# Altium project Light Stairs.PrjPcb
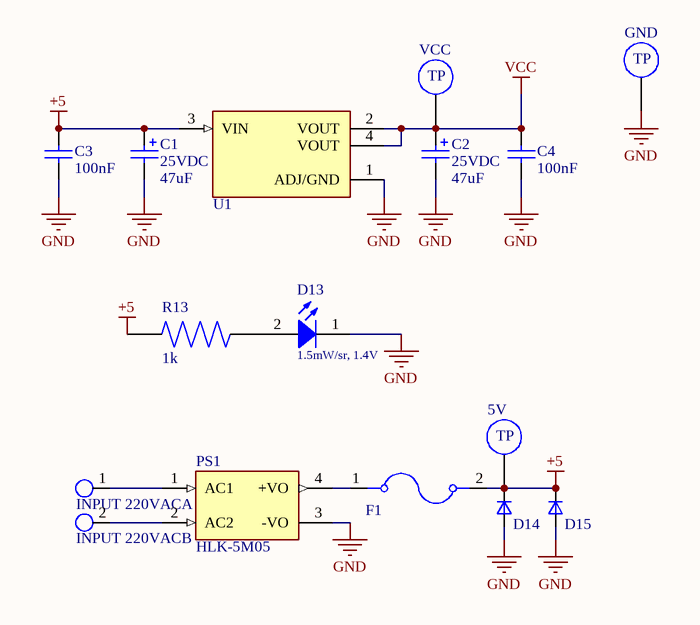
[diagram p0: input.SchDoc]
3 sheets, 76 parts. Net scope: global (net labels, ports and power ports of the same name join across sheets).
Board file: PCB1.PcbDoc
Sheets:
  input.SchDoc
  control.SchDoc
  output.SchDoc

## Sheet input.SchDoc
size A; SheetNumber: 1; SheetTotal: 3

### Parts
(Parts that share a designator on the sheet are numbered #1, #2 ... from top to bottom, then left to right.)
5V  TEST POINT  [Test point]  (value not drawn)  (no BOM)
C1  Rated Voltage: 25VDC  Capacitance: 47uF  [D6.3H7.7]  (hidden comment: Electrolyt Cap)
C2  Rated Voltage: 25VDC  Capacitance: 47uF  [D6.3H7.7]  (hidden comment: Electrolyt Cap)
C3  Capacitance: 100nF  [0603_WAVE]  (hidden comment: Ceramic Cap)
C4  Capacitance: 100nF  [0603_WAVE]  (hidden comment: Ceramic Cap)
D13  1.5mW/sr, 1.4V  [0805_L2W1.3H0.8]
D14  M7 Diode  [SMA]  (value not drawn)
D15  M7 Diode  [SMA]  (value not drawn)
F1  Fuse  [FUSE]  (value not drawn)
GND  TEST POINT  [Test point]  (value not drawn)  (no BOM)
INPUT_220VAC  AK300/2  [AK300/2]  (value not drawn)  (parts A,B of 2)
PS1  HLK-5M05  [HLK-5M05]
R13  value 1k  [1206]  (hidden comment: 1206 Res)
U1#1  AMS1117  [SOT229P700X180-4N]  (value not drawn)
VCC  TEST POINT  [Test point]  (value not drawn)  (no BOM)

### Nets
+5: 5V.TP C1.1(P) C3.2 D14.CATHODE D15.CATHODE F1.2 R13.1 U1#1.3(VIN)
GND: C1.2(N) C2.2(N) C3.1 C4.1 D13.1(K) D14.ANNODE D15.ANNODE GND.TP PS1.3(-VO) U1#1.1(ADJ/GND)
VCC: C2.1(P) C4.2 U1#1.2(VOUT) U1#1.4(VOUT) VCC.TP
NetD13_2: D13.2(A) R13.2
NetF1_1: F1.1 PS1.4(+VO)
NetINPUT_220VAC_1: INPUT_220VAC.1(KL) PS1.1(AC1)
NetINPUT_220VAC_2: INPUT_220VAC.2(KL) PS1.2(AC2)

### Library data of the parts
C1 C2 = Electrolyt Cap: WCAP-ASLI Aluminum Electrolytic Capacitor, V-Chip, SMT, D16xH17mm; Manufacturer Part Number: 865080163018; Manufacturer: Wurth Elektronik; Technical Reference: ASEK170682M6R3DVCTHB000; Ripple Current: 1250mA; Capacitance Tolerance: +/-20%; Leakage Current: 428.4uA; Endurance: 2000h; Dissipation Factor: 24%; Packaging: Tape and Reel; Published Date: October 2020; Operating Temperature: -55 to +105degC; Mounting Technology: SMT; Height: 17mm; ComponentLink1Description: Manufacturer; ComponentLink1URL: http://www.we-online.de; ComponentLink2Description: Datasheet; ComponentLink2URL: https://www.we-online.com/catalog/datasheet/865080163018.pdf; Diameter: 16mm
C3 C4 = Ceramic Cap: WCAP-CSGP Multilayer Ceramic Chip Capacitor, General Purpose, size 1812, X7R; Manufacturer Part Number: 885012210019; Manufacturer: Wurth Elektronik; Rated Voltage: 50VDC; Isolation Resistance: >=10GOhm; Capacitance Tolerance: +/-10%; Technical Reference: X7R1812103K050DFCT10000; ComponentLink1Description: Manufacturer; ComponentLink1URL: http://www.we-online.de; ComponentLink2Description: Datasheet; ComponentLink2URL: https://www.we-online.com/catalog/datasheet/885012210019.pdf; Operating Temperature: -55 to +125degC; Packaging: Tape and Reel; Published Date: May 2020; Ceramic Type: X7R; Dissipation Factor: =<2.5%; Height: 1.25mm; Mounting Technology: SMT; Size: 1812
D13 = 0805 Led: WL-SICW SMT Chip LED Infrared Waterclear, size 0805, 1.5mW/sr, 1.4V; Manufacturer Part Number: 15408085BA400; Manufacturer: Wurth Elektronik; Chip Technology: AlGaAs; Forward Voltage max.: 2V; Centroid Wavelength typ.: 845nm; Peak Wavelength typ.: 850nm; Radiant Intensity min.: 0.6mW/sr; Viewing Angle: 140deg; Radiant Intensity typ.: 1.5mW/sr; ComponentLink1Description: Manufacturer; ComponentLink1URL: http://www.we-online.de; ComponentLink2URL: https://www.we-online.com/catalog/datasheet/15408085BA400.pdf; ComponentLink2Description: Datasheet; Emitting Color: Infrared; Forward Voltage typ.: 1.4V; Mounting Technology: SMT; Operating Temperature: -40 to +85degC; Published Date: August 2020; Packaging: Tape and Reel; Size: 0805
D14 D15 = M7 Diode: Diode Standard 400V 1A Surface Mount SMA _DO-214AC_; MF: ON Semiconductor; MP: S1G; Price: None; Value: *; Availability: Unavailable; SnapEDA_Link: https://www.snapeda.com/parts/S1G/ON%20Semiconductor/view-part/1474196/?ref=snap; Package: DO-214AC ON Semiconductor
F1 = Fuse: 4A 125V AC 125V DC Fuse Board Mount _Cartridge Style Excluded_ Holder, Surface Mount 2-SMD, Square End Block with Holder; MF: Littelfuse Inc.; MP: 0154004.DR; Digi-Key_Part_Number: F1227CT-ND; SnapEDA_Link: https://www.snapeda.com/parts/0154004.DR/Littelfuse%20Inc./view-part/1215896/?ref=snap; Value: *; Digi-Key_Purchase_URL: https://www.digikey.com/product-detail/en/littelfuse-inc/0154004.DR/F1227CT-ND/183376?utm_source=snapeda&utm_medium=aggregator&utm_campaign=symbol; Package: SMD-2 Littelfuse
INPUT_220VAC = AK300/2: MP: AK300/3; MF: Altech; Package: None; Availability: Unavailable; SnapEDA_Link: https://www.snapeda.com/parts/AK300/3/Altech/view-part/2748485/?ref=snap; Check_prices: https://www.snapeda.com/parts/AK300/3/Altech/view-part/2748485/?ref=eda; Value: *; Price: None
PS1 = HLK-5M05: AC DC 220V to 5V 5W 5Watt Isolated Switching Step-Down Power Supply Module Converter; MF: Hi-link; Availability: Unavailable; SnapEDA_Link: https://www.snapeda.com/parts/HLK-5M05/Hi-link/view-part/2758659/?ref=snap; Price: None; Package: Package Analog Devices; MP: HLK-5M05; Value: *
R13 = 1206 Res: Res 1206 10 Ohm 5% 1/8W Â±500ppm/Â°C Molded SMD SMD T/R; Resistance: 10; MP: FCR1206J10R; Power_Rating: .125 W; MF: TE Connectivity; DigiKey-Purchase-URL: https://snapeda.com/shop?store=DigiKey&id=988597; Package: 1206; EU_RoHS_Compliance: Compliant with Exemptions; Tolerance: 5%; Price: None; SnapEDA_Link: https://www.snapeda.com/parts/FCR1206J10R/TE%20Connectivity%20Passive%20Product/view-part/988597/?ref=snap; Mouser-Purchase-URL: https://snapeda.com/shop?store=Mouser&id=988597; Availability: Warning
U1#1 = AMS1117: UNO PLUS Arduino R3 Shield, Xbee Arduino IDE Wheeled Robotics Kit; MF: Seeed Technology; Availability: Unavailable; SnapEDA_Link: https://www.snapeda.com/parts/AMS1117/Seeed%20Technology%20Co.%2C%20Ltd/view-part/184428/?ref=snap; MP: AMS1117; Price: None; Value: *; Package: SOT-223 Seeed Technology

## Sheet control.SchDoc
size A; SheetNumber: 2; SheetTotal: 3
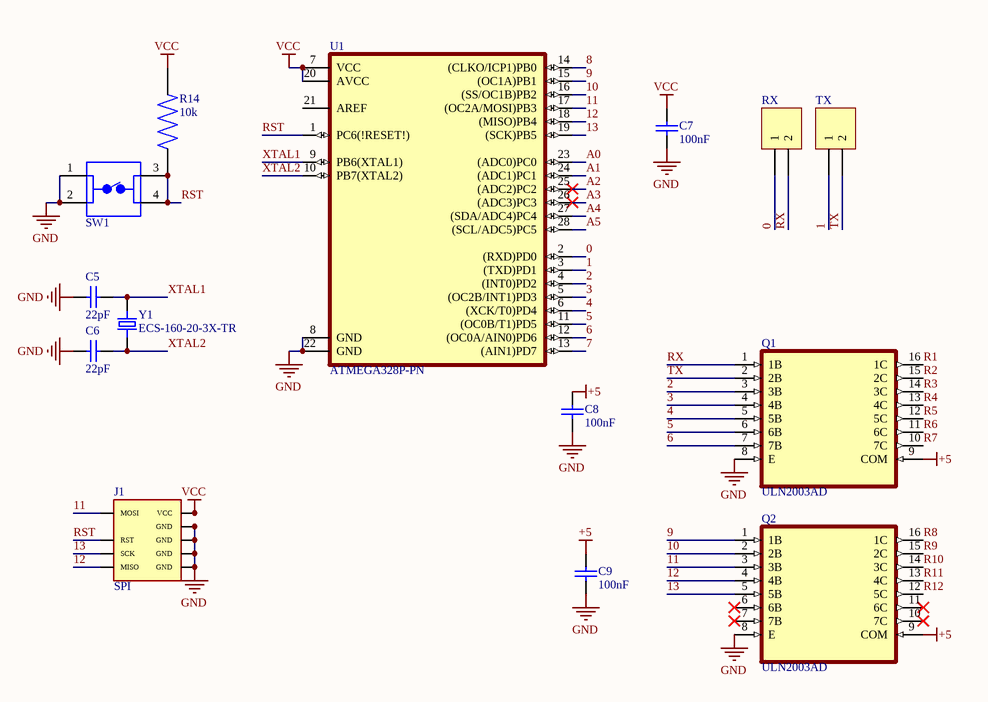
[diagram p1: control.SchDoc]

### Parts
(Parts that share a designator on the sheet are numbered #1, #2 ... from top to bottom, then left to right.)
C5  Capacitance: 22pF  [0603_WAVE]  (hidden comment: Ceramic Cap)
C6  Capacitance: 22pF  [0603_WAVE]  (hidden comment: Ceramic Cap)
C7  Capacitance: 100nF  [0603_WAVE]  (hidden comment: Ceramic Cap)
C8  Capacitance: 100nF  [0603_WAVE]  (hidden comment: Ceramic Cap)
C9  Capacitance: 100nF  [0603_WAVE]  (hidden comment: Ceramic Cap)
J1  SPI  [idc10]
Q1  ULN2003AD  [SOIC127P600X175-16N]
Q2  ULN2003AD  [SOIC127P600X175-16N]
R14  value 10k  [1206]  (hidden comment: 1206 Res)
RX  Header 2  [HDR1X2]  (value not drawn)
SW1  6x4mm Pb  [6x4mm Pb]  (value not drawn)
TX  Header 2  [HDR1X2]  (value not drawn)
U1#2  ATMEGA328P-PN  [DIL28]
Y1  ECS-160-20-3X-TR  [XTAL_ECS-160-20-3X-TR]

### Nets
+5: C8.2 C9.2 Q1.9(COM) Q2.9(COM)
GND: C5.2 C6.2 C7.1 C8.1 C9.1 J1.4(GND) J1.6(GND) J1.8(GND) J1.10(GND) Q1.8(E) Q2.8(E) SW1.1 SW1.2 U1#2.8(GND) U1#2.22(GND)
VCC: C7.2 J1.2(VCC) R14.2 U1#2.7(VCC) U1#2.20(AVCC)
0: RX.1 U1#2.2((RXD)PD0)
1: TX.1 U1#2.3((TXD)PD1)
2: Q1.3(3B) U1#2.4((INT0)PD2)
3: Q1.4(4B) U1#2.5((OC2B/INT1)PD3)
4: Q1.5(5B) U1#2.6((XCK/T0)PD4)
5: Q1.6(6B) U1#2.11((OC0B/T1)PD5)
6: Q1.7(7B) U1#2.12((OC0A/AIN0)PD6)
7: U1#2.13((AIN1)PD7)
8: U1#2.14((CLKO/ICP1)PB0)
9: Q2.1(1B) U1#2.15((OC1A)PB1)
10: Q2.2(2B) U1#2.16((SS/OC1B)PB2)
11: J1.1(MOSI) Q2.3(3B) U1#2.17((OC2A/MOSI)PB3)
12: J1.9(MISO) Q2.4(4B) U1#2.18((MISO)PB4)
13: J1.7(SCK) Q2.5(5B) U1#2.19((SCK)PB5)
A0: U1#2.23((ADC0)PC0)
A1: U1#2.24((ADC1)PC1)
A2: U1#2.25((ADC2)PC2)
A3: U1#2.26((ADC3)PC3)
A4: U1#2.27((SDA/ADC4)PC4)
A5: U1#2.28((SCL/ADC5)PC5)
R1: Q1.16(1C)
R2: Q1.15(2C)
R3: Q1.14(3C)
R4: Q1.13(4C)
R5: Q1.12(5C)
R6: Q1.11(6C)
R7: Q1.10(7C)
R8: Q2.16(1C)
R9: Q2.15(2C)
R10: Q2.14(3C)
R11: Q2.13(4C)
R12: Q2.12(5C)
RST: J1.5(RST) R14.1 SW1.3 SW1.4 U1#2.1(PC6(!RESET!))
RX: Q1.1(1B) RX.2
TX: Q1.2(2B) TX.2
XTAL1: C5.1 U1#2.9(PB6(XTAL1)) Y1.2
XTAL2: C6.1 U1#2.10(PB7(XTAL2)) Y1.1

Not connected (* = marked no-connect by the designer): Q2 6(6B)* 7(7B)* 10(7C)* 11(6C)*; U1#2 21(AREF)

### Library data of the parts
C5-C9 = Ceramic Cap: as C3 on sheet input; ComponentLink1Description: Manufacturer; ComponentLink1URL: http://www.we-online.de; ComponentLink2Description: Datasheet; ComponentLink2URL: https://www.we-online.com/catalog/datasheet/885012210019.pdf; Operating Temperature: -55 to +125degC; Packaging: Tape and Reel; Published Date: May 2020; Ceramic Type: X7R; Dissipation Factor: =<2.5%; Height: 1.25mm; Mounting Technology: SMT; Size: 1812
Q1 Q2 = ULN2003AD: High-Voltage, High-Current Darlington Transistor Arrays; MF: Texas Instruments; Mouser-Purchase-URL: https://snapeda.com/shop?store=Mouser&id=152260; SnapEDA_Link: https://www.snapeda.com/parts/ULN2003AD/Texas%20Instruments/view-part/152260/?ref=snap; Availability: Unavailable; Value: *; Price: None; Arrow_Electronics-Purchase-URL: https://snapeda.com/shop?store=Arrow+Electronics&id=152260; MP: ULN2003AD; DigiKey-Purchase-URL: https://snapeda.com/shop?store=DigiKey&id=152260; Package: SOIC-16 Texas Instruments
R14 = 1206 Res: as R13 on sheet input; DigiKey-Purchase-URL: https://snapeda.com/shop?store=DigiKey&id=988597; Package: 1206; EU_RoHS_Compliance: Compliant with Exemptions; Tolerance: 5%; Price: None; SnapEDA_Link: https://www.snapeda.com/parts/FCR1206J10R/TE%20Connectivity%20Passive%20Product/view-part/988597/?ref=snap; Mouser-Purchase-URL: https://snapeda.com/shop?store=Mouser&id=988597; Availability: Warning
RX TX = Header 2: Header, 2-Pin; LatestRevisionDate: 17-Jul-2002; LatestRevisionNote: Re-released for DXP Platform.; Publisher: Altium Limited
SW1 = 6x4mm Pb: Switch Push Button OFF _ON_ SPST Round Button 0.05A 24VDC Momentary Contact PC Pins Thru-Hole; MF: TE Connectivity; MP: 3-1825910-1; Availability: Unavailable; SnapEDA_Link: https://www.snapeda.com/parts/3-1825910-1/TE%20Connectivity%20ALCOSWITCH%20Switches/view-part/452461/?ref=snap; Price: None; EU_RoHS_Compliance: Compliant; Package: None; TE_purchase_URL: https://www.te.com/usa-en/product-3-1825910-1.html?te_bu=Cor&te_type=disp&te_campaign=seda_glo_cor-seda-global-disp-prtnr-fy19-seda-model-bom-cta_sma-317_1&elqCampaignId=32493; Value: *
U1#2 = ATMEGA328P-PN: AVR AVRÂ® ATmega Microcontroller IC 8-Bit 20MHz 32KB _16K x 16_ FLASH 28-PDIP; MF: Microchip; Availability: Unavailable; SnapEDA_Link: https://www.snapeda.com/parts/ATMEGA328P-PN/Microchip/view-part/396640/?ref=snap; Price: None; Package: PDIP-28 Atmel; MP: ATMEGA328P-PN; Value: *
Y1 = ECS-160-20-3X-TR: 16MHz Â±30ppm Crystal 20pF 50 Ohms HC-49/US; MF: ECS Inc.; Digi-Key_Part_Number: XC1776CT-ND; Digi-Key_Purchase_URL: https://www.digikey.com/product-detail/en/ecs-inc/ECS-160-20-3X-TR/XC1776CT-ND/2676640?utm_source=snapeda&utm_medium=aggregator&utm_campaign=symbol; Package: HC49/US ECS International; MP: ECS-160-20-3X-TR; Value: *; SnapEDA_Link: https://www.snapeda.com/parts/ECS-160-20-3X-TR/ECS%20Inc./view-part/561589/?ref=snap

## Sheet output.SchDoc
size A; SheetNumber: 3; SheetTotal: 3
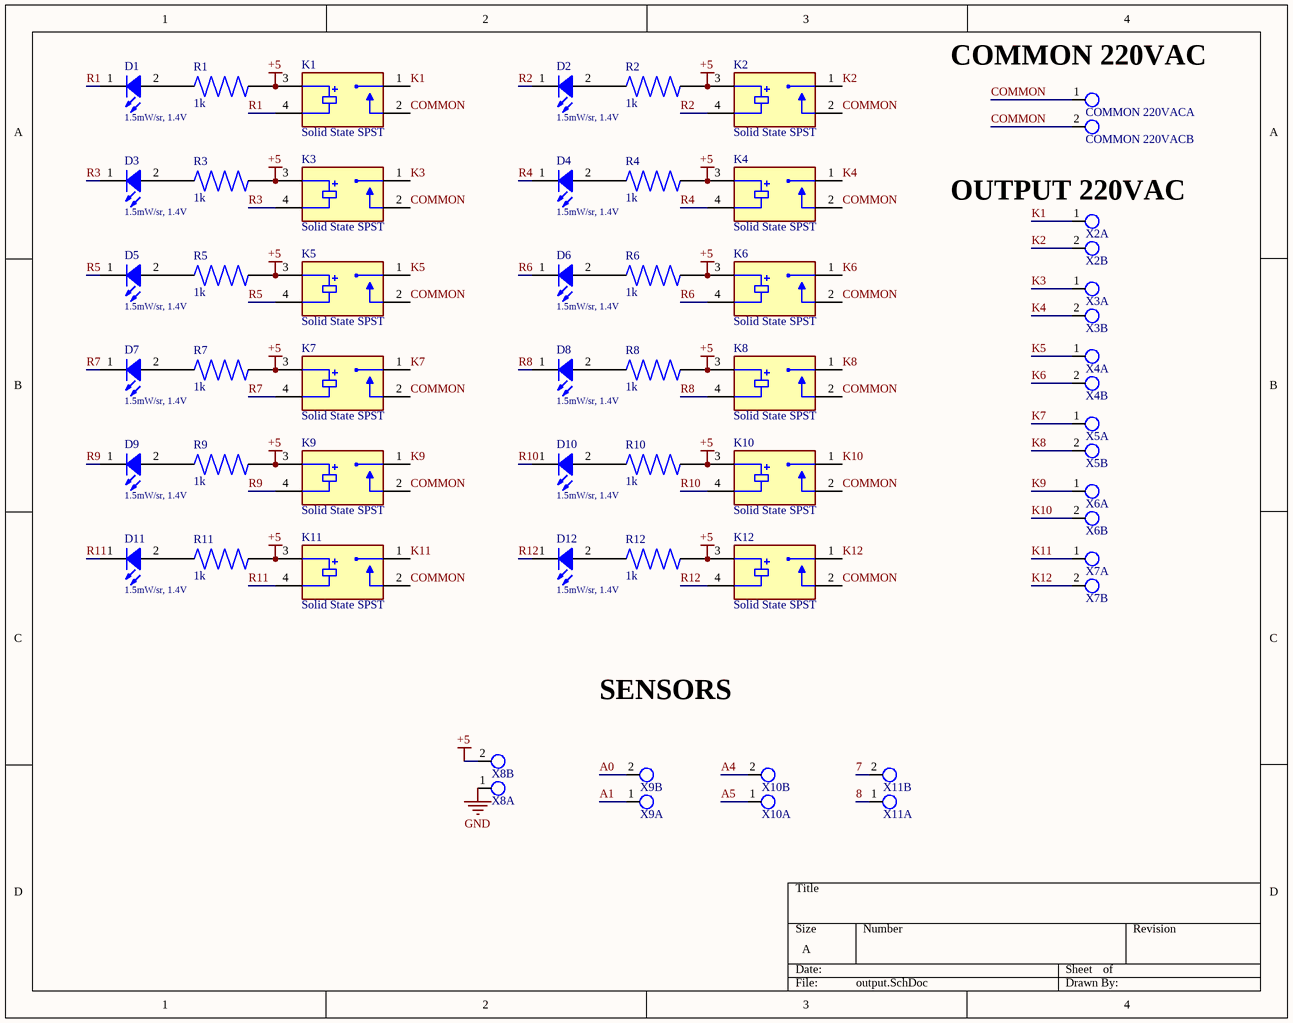
[diagram p2: output.SchDoc]

### Parts
COMMON_220VAC  AK300/2  [AK300/2]  (value not drawn)  (parts A,B of 2)
D1  1.5mW/sr, 1.4V  [0805_L2W1.3H0.8]
D2  1.5mW/sr, 1.4V  [0805_L2W1.3H0.8]
D3  1.5mW/sr, 1.4V  [0805_L2W1.3H0.8]
D4  1.5mW/sr, 1.4V  [0805_L2W1.3H0.8]
D5  1.5mW/sr, 1.4V  [0805_L2W1.3H0.8]
D6  1.5mW/sr, 1.4V  [0805_L2W1.3H0.8]
D7  1.5mW/sr, 1.4V  [0805_L2W1.3H0.8]
D8  1.5mW/sr, 1.4V  [0805_L2W1.3H0.8]
D9  1.5mW/sr, 1.4V  [0805_L2W1.3H0.8]
D10  1.5mW/sr, 1.4V  [0805_L2W1.3H0.8]
D11  1.5mW/sr, 1.4V  [0805_L2W1.3H0.8]
D12  1.5mW/sr, 1.4V  [0805_L2W1.3H0.8]
K1  Solid State SPST  [Solid State SPST]
K2  Solid State SPST  [Solid State SPST]
K3  Solid State SPST  [Solid State SPST]
K4  Solid State SPST  [Solid State SPST]
K5  Solid State SPST  [Solid State SPST]
K6  Solid State SPST  [Solid State SPST]
K7  Solid State SPST  [Solid State SPST]
K8  Solid State SPST  [Solid State SPST]
K9  Solid State SPST  [Solid State SPST]
K10  Solid State SPST  [Solid State SPST]
K11  Solid State SPST  [Solid State SPST]
K12  Solid State SPST  [Solid State SPST]
R1  value 1k  [1206]  (hidden comment: 1206 Res)
R2  value 1k  [1206]  (hidden comment: 1206 Res)
R3  value 1k  [1206]  (hidden comment: 1206 Res)
R4  value 1k  [1206]  (hidden comment: 1206 Res)
R5  value 1k  [1206]  (hidden comment: 1206 Res)
R6  value 1k  [1206]  (hidden comment: 1206 Res)
R7  value 1k  [1206]  (hidden comment: 1206 Res)
R8  value 1k  [1206]  (hidden comment: 1206 Res)
R9  value 1k  [1206]  (hidden comment: 1206 Res)
R10  value 1k  [1206]  (hidden comment: 1206 Res)
R11  value 1k  [1206]  (hidden comment: 1206 Res)
R12  value 1k  [1206]  (hidden comment: 1206 Res)
X2  AK300/2  [AK300/2]  (value not drawn)  (parts A,B of 2)
X3  AK300/2  [AK300/2]  (value not drawn)  (parts A,B of 2)
X4  AK300/2  [AK300/2]  (value not drawn)  (parts A,B of 2)
X5  AK300/2  [AK300/2]  (value not drawn)  (parts A,B of 2)
X6  AK300/2  [AK300/2]  (value not drawn)  (parts A,B of 2)
X7  AK300/2  [AK300/2]  (value not drawn)  (parts A,B of 2)
X8  AK300/2  [AK300/2]  (value not drawn)  (parts A,B of 2)
X9  AK300/2  [AK300/2]  (value not drawn)  (parts A,B of 2)
X10  AK300/2  [AK300/2]  (value not drawn)  (parts A,B of 2)
X11  AK300/2  [AK300/2]  (value not drawn)  (parts A,B of 2)

### Nets
+5: K1.3 K2.3 K3.3 K4.3 K5.3 K6.3 K7.3 K8.3 K9.3 K10.3 K11.3 K12.3 R1.2 R2.2 R3.2 R4.2 R5.2 R6.2 R7.2 R8.2 R9.2 R10.2 R11.2 R12.2 X8.2(KL)
GND: X8.1(KL)
7: X11.2(KL)
8: X11.1(KL)
A0: X9.2(KL)
A1: X9.1(KL)
A4: X10.2(KL)
A5: X10.1(KL)
COMMON: COMMON_220VAC.1(KL) COMMON_220VAC.2(KL) K1.2 K2.2 K3.2 K4.2 K5.2 K6.2 K7.2 K8.2 K9.2 K10.2 K11.2 K12.2
K1: K1.1 X2.1(KL)
K2: K2.1 X2.2(KL)
K3: K3.1 X3.1(KL)
K4: K4.1 X3.2(KL)
K5: K5.1 X4.1(KL)
K6: K6.1 X4.2(KL)
K7: K7.1 X5.1(KL)
K8: K8.1 X5.2(KL)
K9: K9.1 X6.1(KL)
K10: K10.1 X6.2(KL)
K11: K11.1 X7.1(KL)
K12: K12.1 X7.2(KL)
R1: D1.1(K) K1.4
R2: D2.1(K) K2.4
R3: D3.1(K) K3.4
R4: D4.1(K) K4.4
R5: D5.1(K) K5.4
R6: D6.1(K) K6.4
R7: D7.1(K) K7.4
R8: D8.1(K) K8.4
R9: D9.1(K) K9.4
R10: D10.1(K) K10.4
R11: D11.1(K) K11.4
R12: D12.1(K) K12.4
NetD1_2: D1.2(A) R1.1
NetD2_2: D2.2(A) R2.1
NetD3_2: D3.2(A) R3.1
NetD4_2: D4.2(A) R4.1
NetD5_2: D5.2(A) R5.1
NetD6_2: D6.2(A) R6.1
NetD7_2: D7.2(A) R7.1
NetD8_2: D8.2(A) R8.1
NetD9_2: D9.2(A) R9.1
NetD10_2: D10.2(A) R10.1
NetD11_2: D11.2(A) R11.1
NetD12_2: D12.2(A) R12.1

### Notes on the sheet
- (near COMMON_220VAC) COMMON 220VAC
- (near X2) OUTPUT 220VAC
- SENSORS

### Library data of the parts
COMMON_220VAC X2-X11 = AK300/2: MP: AK300/3; MF: Altech; Package: None; Availability: Unavailable; SnapEDA_Link: https://www.snapeda.com/parts/AK300/3/Altech/view-part/2748485/?ref=snap; Check_prices: https://www.snapeda.com/parts/AK300/3/Altech/view-part/2748485/?ref=eda; Value: *; Price: None
D1-D12 = 0805 Led: as D13 on sheet input; Radiant Intensity typ.: 1.5mW/sr; ComponentLink1Description: Manufacturer; ComponentLink1URL: http://www.we-online.de; ComponentLink2URL: https://www.we-online.com/catalog/datasheet/15408085BA400.pdf; ComponentLink2Description: Datasheet; Emitting Color: Infrared; Forward Voltage typ.: 1.4V; Mounting Technology: SMT; Operating Temperature: -40 to +85degC; Published Date: August 2020; Packaging: Tape and Reel; Size: 0805
K1-K12 = Solid State SPST: Solid State SPST-NO (1 Form A) 4-SIP; MF: Omron Automation; MP: G3MB-202P DC5; Price: None; SnapEDA_Link: https://www.snapeda.com/parts/G3MB-202P%20DC5/Omron%20Automation%20and%20Safety/view-part/914581/?ref=snap; Value: *; Package: SIP-4 Omron; Availability: Unavailable
R1-R12 = 1206 Res: as R13 on sheet input; DigiKey-Purchase-URL: https://snapeda.com/shop?store=DigiKey&id=988597; Package: 1206; EU_RoHS_Compliance: Compliant with Exemptions; Tolerance: 5%; Price: None; SnapEDA_Link: https://www.snapeda.com/parts/FCR1206J10R/TE%20Connectivity%20Passive%20Product/view-part/988597/?ref=snap; Mouser-Purchase-URL: https://snapeda.com/shop?store=Mouser&id=988597; Availability: Warning

## Nets that join several sheets
+5: input (8 pins), control (C8.2 C9.2 Q1.9 Q2.9), output (25 pins)
GND: input (10 pins), control (15 pins), output (X8.1)
VCC: input (5 pins), control (5 pins)
7: control (U1#2.13), output (X11.2)
8: control (U1#2.14), output (X11.1)
A0: control (U1#2.23), output (X9.2)
A1: control (U1#2.24), output (X9.1)
A4: control (U1#2.27), output (X10.2)
A5: control (U1#2.28), output (X10.1)
R1: control (Q1.16), output (D1.1 K1.4)
R2: control (Q1.15), output (D2.1 K2.4)
R3: control (Q1.14), output (D3.1 K3.4)
R4: control (Q1.13), output (D4.1 K4.4)
R5: control (Q1.12), output (D5.1 K5.4)
R6: control (Q1.11), output (D6.1 K6.4)
R7: control (Q1.10), output (D7.1 K7.4)
R8: control (Q2.16), output (D8.1 K8.4)
R9: control (Q2.15), output (D9.1 K9.4)
R10: control (Q2.14), output (D10.1 K10.4)
R11: control (Q2.13), output (D11.1 K11.4)
R12: control (Q2.12), output (D12.1 K12.4)